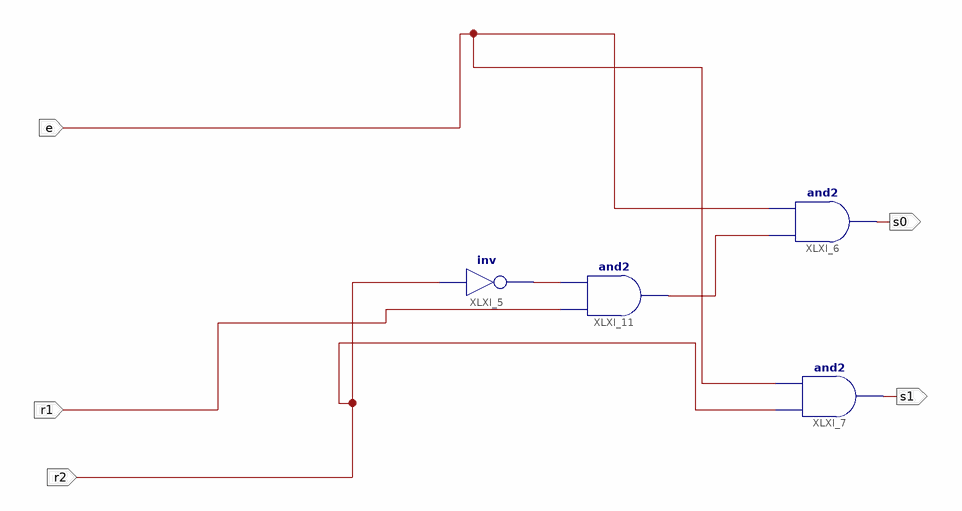
[diagram p0: schematic sheet 1]
// Xilinx ISE schematic prioritencoder.sch (artix7) as structural Verilog: 4 symbols, 5 ports
module prioritencoder (
  input  r2,
  input  e,
  input  r1,
  output s0,
  output s1
);

  wire XLXN_8, XLXN_10;

  not XLXI_5 (XLXN_8, r2);
  and XLXI_6 (s0, XLXN_10, e);
  and XLXI_7 (s1, r2, e);
  and XLXI_11 (XLXN_10, r1, XLXN_8);
endmodule
